# Altium project hdmi.PrjPCB
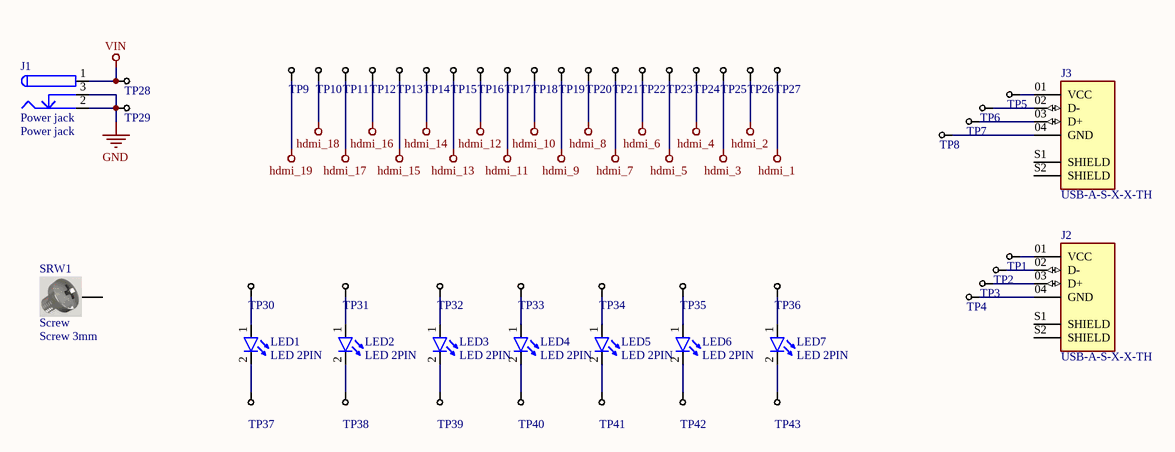
[diagram p0: hdmi.SchDoc]
1 sheet, 54 parts. Net scope: global (net labels, ports and power ports of the same name join across sheets).
Board files: hdmi.PcbDoc, PCB1.PcbDoc

## Sheet hdmi.SchDoc
size A

### Parts
J1  Power jack  [Power Jack]
J2  USB-A-S-X-X-TH  [SAMTEC_USB-A-S-X-X-TH]
J3  USB-A-S-X-X-TH  [SAMTEC_USB-A-S-X-X-TH]
LED1  LED 2PIN  [LED 5mm]
LED2  LED 2PIN  [LED 5mm]
LED3  LED 2PIN  [LED 5mm]
LED4  LED 2PIN  [LED 5mm]
LED5  LED 2PIN  [LED 5mm]
LED6  LED 2PIN  [LED 5mm]
LED7  LED 2PIN  [LED 5mm]
SRW1  Screw  [mini hdmi socket]
TP1  TEST POINT  [Test Point On Top]  (value not drawn)
TP2  TEST POINT  [Test Point On Top]  (value not drawn)
TP3  TEST POINT  [Test Point On Top]  (value not drawn)
TP4  TEST POINT  [Test Point On Top]  (value not drawn)
TP5  TEST POINT  [Test Point On Top]  (value not drawn)
TP6  TEST POINT  [Test Point On Top]  (value not drawn)
TP7  TEST POINT  [Test Point On Top]  (value not drawn)
TP8  TEST POINT  [Test Point On Top]  (value not drawn)
TP9  TEST POINT  [Test Point On Top]  (value not drawn)
TP10  TEST POINT  [Test Point On Top]  (value not drawn)
TP11  TEST POINT  [Test Point On Top]  (value not drawn)
TP12  TEST POINT  [Test Point On Top]  (value not drawn)
TP13  TEST POINT  [Test Point On Top]  (value not drawn)
TP14  TEST POINT  [Test Point On Top]  (value not drawn)
TP15  TEST POINT  [Test Point On Top]  (value not drawn)
TP16  TEST POINT  [Test Point On Top]  (value not drawn)
TP17  TEST POINT  [Test Point On Top]  (value not drawn)
TP18  TEST POINT  [Test Point On Top]  (value not drawn)
TP19  TEST POINT  [Test Point On Top]  (value not drawn)
TP20  TEST POINT  [Test Point On Top]  (value not drawn)
TP21  TEST POINT  [Test Point On Top]  (value not drawn)
TP22  TEST POINT  [Test Point On Top]  (value not drawn)
TP23  TEST POINT  [Test Point On Top]  (value not drawn)
TP24  TEST POINT  [Test Point On Top]  (value not drawn)
TP25  TEST POINT  [Test Point On Top]  (value not drawn)
TP26  TEST POINT  [Test Point On Top]  (value not drawn)
TP27  TEST POINT  [Test Point On Top]  (value not drawn)
TP28  TEST POINT  [Test Point On Top]  (value not drawn)
TP29  TEST POINT  [Test Point On Top]  (value not drawn)
TP30  TEST POINT  [Test Point On Top]  (value not drawn)
TP31  TEST POINT  [Test Point On Top]  (value not drawn)
TP32  TEST POINT  [Test Point On Top]  (value not drawn)
TP33  TEST POINT  [Test Point On Top]  (value not drawn)
TP34  TEST POINT  [Test Point On Top]  (value not drawn)
TP35  TEST POINT  [Test Point On Top]  (value not drawn)
TP36  TEST POINT  [Test Point On Top]  (value not drawn)
TP37  TEST POINT  [Test Point On Top]  (value not drawn)
TP38  TEST POINT  [Test Point On Top]  (value not drawn)
TP39  TEST POINT  [Test Point On Top]  (value not drawn)
TP40  TEST POINT  [Test Point On Top]  (value not drawn)
TP41  TEST POINT  [Test Point On Top]  (value not drawn)
TP42  TEST POINT  [Test Point On Top]  (value not drawn)
TP43  TEST POINT  [Test Point On Top]  (value not drawn)

### Nets
GND: J1.2 J1.3 TP29.1(T)
hdmi_1: TP27.1(T)
hdmi_2: TP26.1(T)
hdmi_3: TP25.1(T)
hdmi_4: TP24.1(T)
hdmi_5: TP23.1(T)
hdmi_6: TP22.1(T)
hdmi_7: TP21.1(T)
hdmi_8: TP20.1(T)
hdmi_9: TP19.1(T)
hdmi_10: TP18.1(T)
hdmi_11: TP17.1(T)
hdmi_12: TP16.1(T)
hdmi_13: TP15.1(T)
hdmi_14: TP14.1(T)
hdmi_15: TP13.1(T)
hdmi_16: TP12.1(T)
hdmi_17: TP11.1(T)
hdmi_18: TP10.1(T)
hdmi_19: TP9.1(T)
VIN: J1.1 TP28.1(T)
NetJ2_01: J2.01(VCC) TP1.1(T)
NetJ2_02: J2.02(D-) TP2.1(T)
NetJ2_03: J2.03(D+) TP3.1(T)
NetJ2_04: J2.04(GND) TP4.1(T)
NetJ3_01: J3.01(VCC) TP5.1(T)
NetJ3_02: J3.02(D-) TP6.1(T)
NetJ3_03: J3.03(D+) TP7.1(T)
NetJ3_04: J3.04(GND) TP8.1(T)
NetLED1_1: LED1.1(A) TP30.1(T)
NetLED1_2: LED1.2(K) TP37.1(T)
NetLED2_1: LED2.1(A) TP31.1(T)
NetLED2_2: LED2.2(K) TP38.1(T)
NetLED3_1: LED3.1(A) TP32.1(T)
NetLED3_2: LED3.2(K) TP39.1(T)
NetLED4_1: LED4.1(A) TP33.1(T)
NetLED4_2: LED4.2(K) TP40.1(T)
NetLED5_1: LED5.1(A) TP34.1(T)
NetLED5_2: LED5.2(K) TP41.1(T)
NetLED6_1: LED6.1(A) TP35.1(T)
NetLED6_2: LED6.2(K) TP42.1(T)
NetLED7_1: LED7.1(A) TP36.1(T)
NetLED7_2: LED7.2(K) TP43.1(T)

Not connected (* = marked no-connect by the designer): J2 S1(SHIELD) S2(SHIELD); J3 S1(SHIELD) S2(SHIELD); SRW1 1(S)

### Notes on the sheet
- (in symbol Screw) Screw 3mm

### Library data of the parts
J2 J3 = USB-A-S-X-X-TH: USB-A (USB TYPE-A) USB 2.0 Receptacle Connector 4 Position Through Hole, Right Angle; MP: USB-A-S-S-W-TH; MF: Samtec; Package: None; Value: *; SnapEDA_Link: https://www.snapeda.com/parts/USB-A-S-S-W-TH/Samtec%20Inc./view-part/423470/?ref=snap; Digi-Key_Part_Number: SAM10373-ND; Toby_UK-Purchase-URL: https://snapeda.com/shop?store=Toby+UK&id=423470